# EAGLE design icestamp1k (EAGLE 9.6.2)
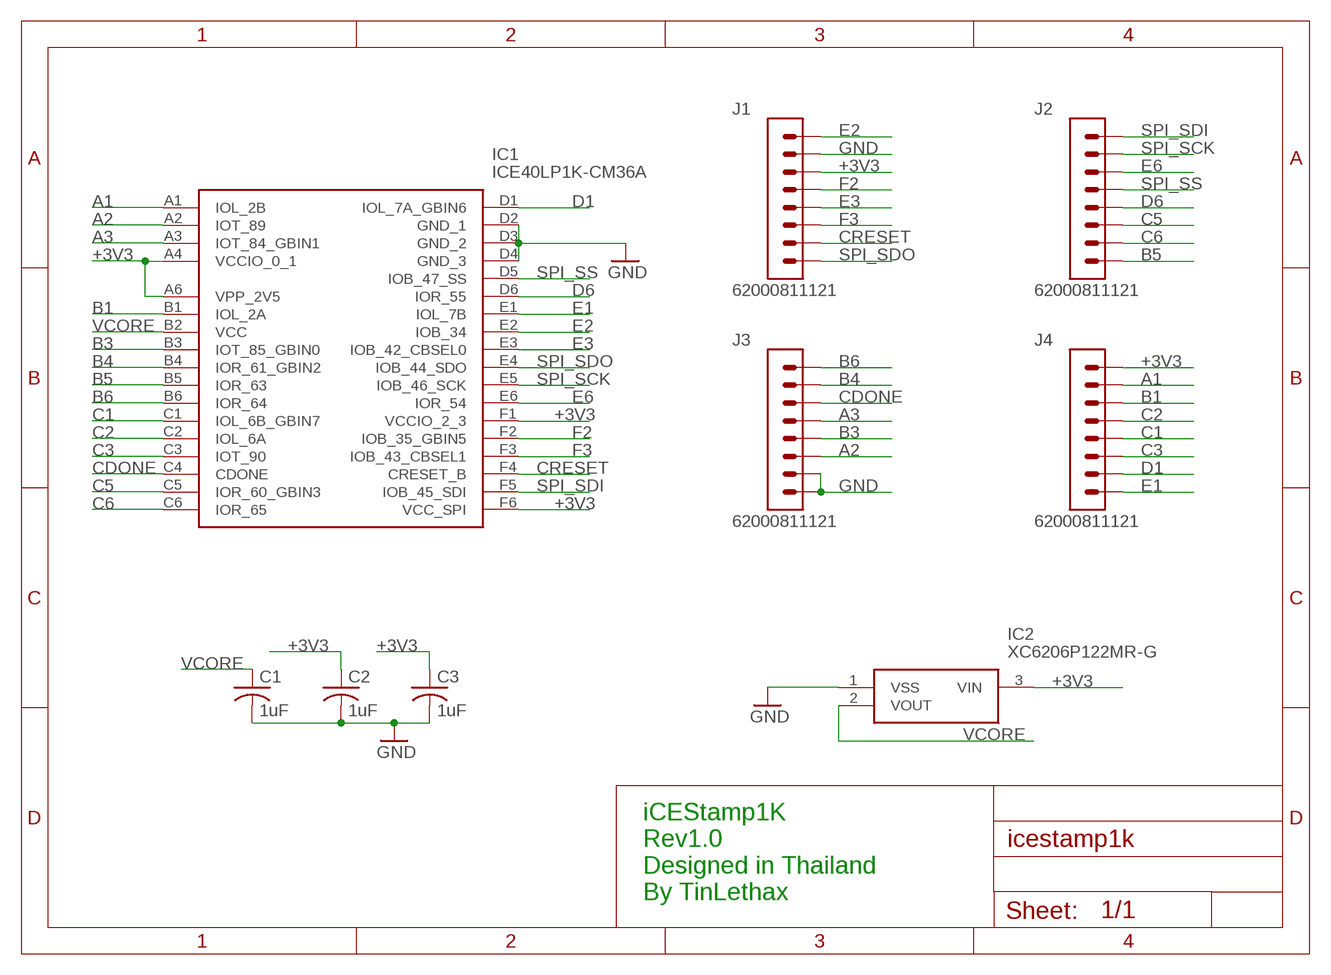
[diagram p0: schematic, sheet 1]

## Parts
C1  1uF  C-USC0603  [C0603]
C2  1uF  C-USC0603  [C0603]
C3  1uF  C-USC0603  [C0603]
IC1  ICE40LP1K-CM36A  [BGA36C40P6X6_250X250X100]
IC2  XC6206P122MR-G  [SOT95P280X130-3N]
J1  62000811121  [62000811121]
J2  62000811121  [62000811121]
J3  62000811121  [62000811121]
J4  62000811121  [62000811121]

## Nets
+3V3: C2.1 C3.1 IC1.A4(VCCIO_0_1) IC1.A6(VPP_2V5) IC1.F1(VCCIO_2_3) IC1.F6(VCC_SPI) IC2.3(VIN) J1.3 J4.1
A1: IC1.A1(IOL_2B) J4.2
A2: IC1.A2(IOT_89) J3.6
A3: IC1.A3(IOT_84_GBIN1) J3.4
B1: IC1.B1(IOL_2A) J4.3
B3: IC1.B3(IOT_85_GBIN0) J3.5
B4: IC1.B4(IOR_61_GBIN2) J3.2
B5: IC1.B5(IOR_63) J2.8
B6: IC1.B6(IOR_64) J3.1
C1: IC1.C1(IOL_6B_GBIN7) J4.5
C2: IC1.C2(IOL_6A) J4.4
C3: IC1.C3(IOT_90) J4.6
C5: IC1.C5(IOR_60_GBIN3) J2.6
C6: IC1.C6(IOR_65) J2.7
CDONE: IC1.C4(CDONE) J3.3
CRESET: IC1.F4(CRESET_B) J1.7
D1: IC1.D1(IOL_7A_GBIN6) J4.7
D6: IC1.D6(IOR_55) J2.5
E1: IC1.E1(IOL_7B) J4.8
E2: IC1.E2(IOB_34) J1.1
E3: IC1.E3(IOB_42_CBSEL0) J1.5
E6: IC1.E6(IOR_54) J2.3
F2: IC1.F2(IOB_35_GBIN5) J1.4
F3: IC1.F3(IOB_43_CBSEL1) J1.6
GND: C1.2 C2.2 C3.2 IC1.D2(GND_1) IC1.D3(GND_2) IC1.D4(GND_3) IC2.1(VSS) J1.2 J3.7 J3.8
SPI_SCK: IC1.E5(IOB_46_SCK) J2.2
SPI_SDI: IC1.F5(IOB_45_SDI) J2.1
SPI_SDO: IC1.E4(IOB_44_SDO) J1.8
SPI_SS: IC1.D5(IOB_47_SS) J2.4
VCORE: C1.1 IC1.B2(VCC) IC2.2(VOUT)

## Notes on the sheet
- iCEStamp1K
  Rev1.0
- Designed in Thailand
  By TinLethax

## Library data of the parts
C1-C3 = adafruit:C-US: CAPACITOR, American symbol
IC1 = ICE40LP1K-CM36A:ICE40LP1K-CM36A: iCE40 LP/HX/LM - Low-power, high-performance FPGA Source: Datasheet <http://www.latticesemi.com/iCE40>; DESCRIPTION: iCE40 LP/HX/LM - Low-power, high-performance FPGA; HEIGHT: 1mm; MANUFACTURER_NAME: Lattice Semiconductor; MANUFACTURER_PART_NUMBER: ICE40LP1K-CM36A; MOUSER_PART_NUMBER: 842-ICE40LP1K-CM36A; MOUSER_PRICE-STOCK: https://www.mouser.co.uk/ProductDetail/Lattice/ICE40LP1K-CM36A?qs=w%2Fv1CP2dgqpOjceq4EogWg%3D%3D
IC2 = XC6206P122MR-G:XC6206P122MR-G: LDO Voltage Regulators 1uA Low Quiescent 3 Terminal, Low ESR Cap. Compatible, Voltage Regulator Source: Datasheet <https://www.torexsemi.com/file/xc6206/XC6206.pdf>; DESCRIPTION: LDO Voltage Regulators 1uA Low Quiescent 3 Terminal, Low ESR Cap. Compatible, Voltage Regulator; HEIGHT: 1.3mm; MANUFACTURER_NAME: Torex; MANUFACTURER_PART_NUMBER: XC6206P122MR-G; MOUSER_PART_NUMBER: 865-XC6206P122MR-G; MOUSER_PRICE-STOCK: https://www.mouser.co.uk/ProductDetail/Torex-Semiconductor/XC6206P122MR-G?qs=AsjdqWjXhJ%2F35%2FU%2FZk2JYg%3D%3D
J1-J4 = Headers:62000811121: THT Vertical Pin Header WR-PHD, Pitch 2.00 mm, Single Row, 8 pins Manufacturer's datasheet <https://datasheet.octopart.com/62000811121-W%C3%BCrth-Elektronik-datasheet-117282012.pdf>; CREATED_BY: PCBLayout.com; MANUFACTURER: Würth Elektronik; MPN: 62000811121

## Board
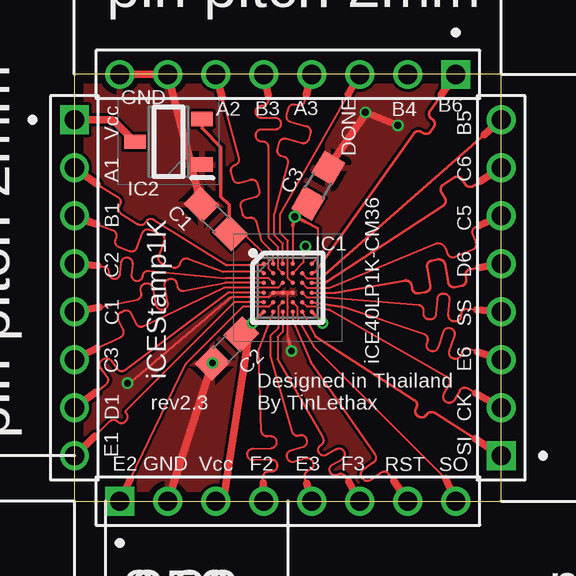
[diagram p1: board, top side]
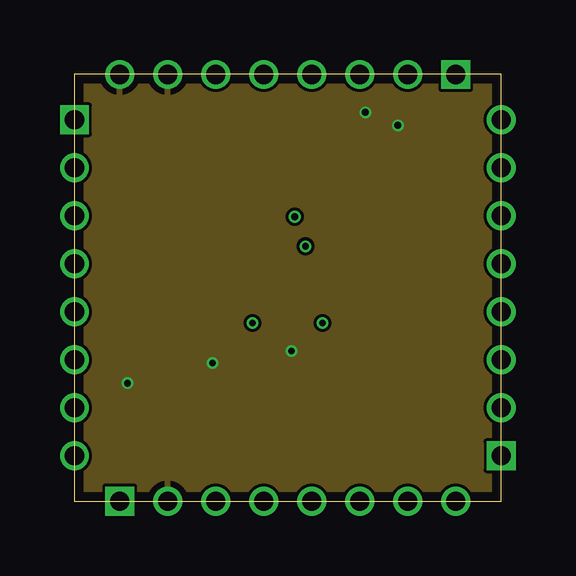
[diagram p2: board, inner layer Route2]
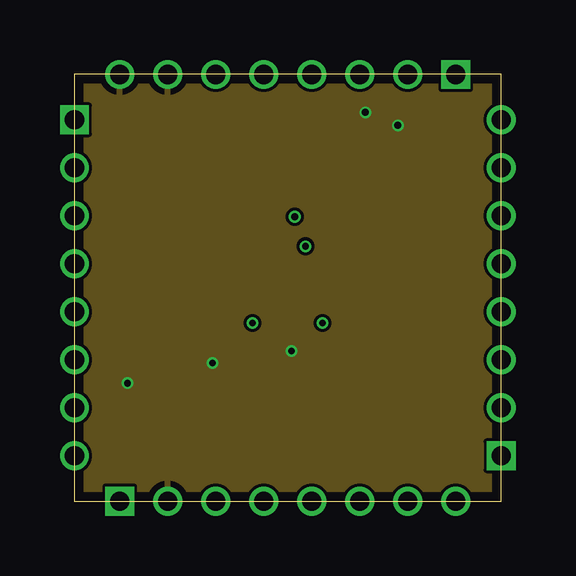
[diagram p3: board, inner layer Route15]
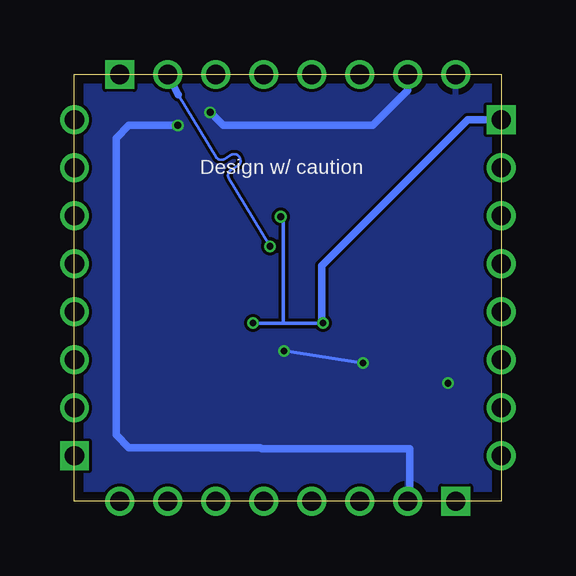
[diagram p4: board, bottom side, seen from below]

Size 17.78 x 17.78 mm. Coordinates in mm from the lower left corner, seen from the top.
Outline: 0,0 17.78,0 17.78,17.78 0,17.78 0,0
Copper layers (1*2*15*16): Top 0.035559375mm / dielectric 0.17018125mm / Route2 0.01778125mm / dielectric 47mil / Route15 0.01778125mm / dielectric 0.17018125mm / Bottom 0.035559375mm
Design rules "oshpark-4layer *": minimum track width 3mil, minimum drill 10mil, track to track 5mil, track to pad 5mil, pad to pad 5mil, via to via 5mil, smd to smd 5mil, copper to edge 15mil, drill to drill 6mil, minimum pad ring 4mil, minimum via ring 4mil, stop-mask expansion 0mil, vias tented up to drill 0mil, thermal gap 10mil

### Footprints (pad centres in the part's own frame; a part is rotated, then mirrored left to right if it is on the bottom)
C0603 = smd 1.1 x 1: 1 -0.85,0; 2 0.85,0
BGA36C40P6X6_250X250X100 = smd 0.18 x 0.18: A1 -1,1; A2 -0.6,1; A3 -0.2,1; A4 0.2,1; A6 1,1; B1 -1,0.6; B2 -0.6,0.6; B3 -0.2,0.6; B4 0.2,0.6; B5 0.6,0.6; B6 1,0.6; C1 -1,0.2; C2 -0.6,0.2; C3 -0.2,0.2; C4 0.2,0.2; C5 0.6,0.2; C6 1,0.2; D1 -1,-0.2; D2 -0.6,-0.2; D3 -0.2,-0.2; D4 0.2,-0.2; D5 0.6,-0.2; D6 1,-0.2; E1 -1,-0.6; E2 -0.6,-0.6; E3 -0.2,-0.6; E4 0.2,-0.6; E5 0.6,-0.6; E6 1,-0.6; F1 -1,-1; F2 -0.6,-1; F3 -0.2,-1; F4 0.2,-1; F5 0.6,-1; F6 1,-1
SOT95P280X130-3N = smd 0.9 x 0.6: 1 -1.4,0.95; 2 -1.4,-0.95; 3 1.4,0
62000811121 = drill 0.8 square: 1 -7,0 | drill 0.8: 2 -5,0; 3 -3,0; 4 -1,0; 5 1,0; 6 3,0; 7 5,0; 8 7,0

### Placement (x,y rotation side)
C1  5.89,11.76 135 top
C2  6.35,6.35 225 top
C3  10.16,13.14 60 top
IC1  8.89,8.89 0 top
IC2  3.92,14.97 180 top
J1  8.89,0 0 top
J2  17.78,8.89 90 top
J3  8.89,17.78 180 top
J4  0,8.89 270 top

### Tracks (layer width: path | path; a pad name or v marks a point on that pad's centre or on a via)
+3V3  (via drill 0.28)
  Top 0.089: 10.13,11.38 10.13,10.13 IC1.A6 | 9.09,11.48 IC1.A4
  Top 0.102: 9.62,11.63 10.13,11.38 | v9.18,11.85 C3.1
  Top 0.152: IC1.F1 v7.42,7.42 C2.1 7.11,6.8 7.25,6.77 | IC1.F6 10.34,7.44 v10.34,7.42 | 9.09,11.48 v9.18,11.85 9.62,11.63
  Top 0.305: 7.25,6.77 6.27,0.38 J1.3 | J4.1 1.61,15.89 IC2.3
  Bottom 0.152: v10.34,7.42 9.07,7.42 | 9.07,7.42 v7.42,7.42 | v9.18,11.85 9.07,11.73 9.07,7.42
  Bottom 0.305: J4.1 1.4,15.89 7.48,9.8 7.48,7.48 v7.42,7.42
A1
  Top 0.089: IC1.A1 7.83,9.83 6.35,9.83 3.32,11.73 arc90 2.99,11.65 2.97,11.62 arc-90 2.65,11.54 1.95,11.98 arc-90 1.87,12.3 1.89,12.34 arc90 1.82,12.66 0.96,13.2 0.23,13.66 J4.2
  Top 0.305: J4.2 0.96,13.2
A2
  Top 0.089: IC1.A2 8.29,10.35 7.79,10.85 7.58,11.64 arc90 7.29,11.81 arc-90 7,11.97 6.92,12.25 arc-90 7.09,12.54 7.54,12.66 arc90 7.7,12.95 7.63,13.23 arc90 7.34,13.39 6.89,13.27 arc-90 6.6,13.43 6.52,13.71 arc-90 6.69,14 arc90 6.85,14.29 6.16,16.8
  Top 0.305: J3.6 6.16,16.8
A3
  Top 0.089: IC1.A3 8.69,10.73 8.33,11.09 8.33,11.98 8.89,14.07 arc90 8.73,14.35 8.62,14.38 arc-90 8.45,14.67 8.52,14.93 arc-90 8.81,15.09 9.48,14.91 arc90 9.77,15.08 9.83,15.34 arc90 9.67,15.62 9,15.8 arc-90 8.84,16.09 8.9,16.35 arc-90 9.19,16.51 9.3,16.48 arc90 9.59,16.65 9.66,16.93
  Top 0.305: J3.4 9.66,16.93
B1
  Top 0.089: IC1.B1 7.83,9.55 6.19,9.55 4.74,10.1 arc90 4.44,9.96 4.41,9.88 arc-90 4.1,9.74 3.64,9.91 arc-90 3.5,10.22 3.74,10.83 arc90 3.6,11.13 3.14,11.31 arc90 2.84,11.17 2.6,10.56 arc-90 2.3,10.42 1.84,10.59 arc-90 1.7,10.9 1.74,10.98 arc90 1.6,11.29 0.93,11.54
  Top 0.305: J4.3 0.69,11.63 0.93,11.54
B3
  Top 0.089: IC1.B3 8.49,9.69 8.49,10.57 8.08,10.99 8.08,14.76 arc90 7.84,14.99 7.79,14.99 arc-90 7.55,15.23 7.55,15.25 arc-90 7.79,15.48 8.37,15.48 arc90 8.6,15.72 8.6,15.74 arc90 8.37,15.97 7.79,15.97 arc-90 7.55,16.21 7.55,16.23 arc-90 7.79,16.46 7.84,16.46 arc90 8.08,16.7 8.08,16.9
  Top 0.305: J3.5 8.08,16.9
B4  (via drill 0.28)
  Top 0.089: 9.54,10.2 9.54,9.94 IC1.B4
  Top 0.152: v9.63,10.62 9.54,10.2
  Bottom 0.102: 13.44,16.94 11.87,14.34 arc-90 11.54,14.25 11.25,14.43 arc90 10.92,14.35 10.89,14.3 arc90 10.97,13.97 11.26,13.79 arc-90 11.35,13.46 9.65,10.64 v9.63,10.62
  Bottom 0.305: J3.2 13.44,16.94
B5
  Top 0.089: IC1.B5 9.69,9.29 10.27,9.29 | 10.27,9.29 | 10.27,9.29 10.27,9.3
  Top 0.102: 17.07,15.27 10.27,9.29
  Top 0.305: J2.8 17.07,15.27
B6
  Top 0.102: IC1.B6 9.94,9.54 10.03,9.54 10.28,9.89 14.14,15.32 arc-90 14.48,15.37 14.51,15.35 arc90 14.85,15.4 14.97,15.57 arc90 14.91,15.91 14.88,15.94 arc-90 14.82,16.27 15.28,16.92
  Top 0.305: J3.1 15.29,16.93 15.28,16.92
C1
  Top 0.089: IC1.C1 6.28,9.09 6.27,9.09 4.56,8.77 arc-90 4.29,8.95 4.26,9.08 arc90 3.99,9.26 3.95,9.26 arc90 3.76,8.98 3.9,8.27 arc-90 3.71,8 3.67,7.99 arc-90 3.4,8.17 3.26,8.88 arc90 2.99,9.07 2.95,9.06 arc90 2.76,8.79 2.79,8.66 arc-90 2.6,8.39 1.03,8.09
  Top 0.305: J4.5 1.03,8.09
C2
  Top 0.089: IC1.C2 8.09,9.29 6.31,9.29 6.3,9.3 3.1,9.6 arc90 2.85,9.38 arc-90 2.59,9.17 2.59,9.17 arc-90 2.38,9.43 2.42,9.9 arc90 2.21,10.15 2.21,10.15 arc90 1.95,9.94 1.91,9.47 arc-90 1.65,9.26 1.65,9.26 arc-90 1.44,9.52 arc90 1.22,9.78 0.98,9.8
  Top 0.305: J4.4 0.98,9.8
C3
  Top 0.089: IC1.C3 8.49,8.89 6.22,8.89 2.88,7.29 arc-90 2.56,7.4 2.37,7.82 arc90 2.05,7.93 1.95,7.88 arc90 1.83,7.56 2.03,7.15 arc-90 1.92,6.83 0.93,6.36
  Top 0.305: J4.6 0.05,5.94 0.93,6.36
C5
  Top 0.089: IC1.C5 | IC1.C5 9.69,8.89 10.63,8.89 15.03,10.72 arc-90 15.45,10.55 15.55,10.29 arc90 15.85,10.17 16.61,10.49 arc90 16.74,10.79 16.6,11.12 arc-90 16.73,11.43 16.88,11.49
  Top 0.305: J2.6 16.88,11.49
C6
  Top 0.089: IC1.C6 10.45,9.09
  Top 0.102: 16.92,13.33 16.62,13.13 arc-90 16.28,13.2 16.15,13.4 arc90 15.81,13.47 15.37,13.18 arc90 15.3,12.85 15.43,12.64 arc-90 15.36,12.31 10.45,9.09
  Top 0.305: J2.7 16.92,13.33
CDONE
  Top 0.089: IC1.C4 8.89,9.29 8.89,10.86 8.59,11.16 8.59,11.98 11.42,16.95
  Top 0.305: J3.3 11.42,16.95
CRESET
  Top 0.089: IC1.F4 9.09,7.53 9.85,5.8 12.53,1.95 arc-90 12.48,1.62 12.04,1.31 arc90 11.98,0.99 12.02,0.94 arc90 12.34,0.88 12.78,1.18 arc-90 13.11,1.12 13.3,0.85
  Top 0.305: J1.7 13.3,0.85
D1
  Top 0.089: IC1.D1 6.39,8.69 2.12,5.46 arc-90 1.79,5.51 1.52,5.86 arc90 1.19,5.91 1.15,5.87 arc90 1.1,5.54 1.36,5.19 arc-90 1.32,4.86 0.89,4.54
  Top 0.305: J4.7 0.89,4.54
D6
  Top 0.089: IC1.D6 10.88,8.69
  Top 0.102: 16.84,9.73 16.5,9.67 arc90 16.3,9.39 16.33,9.25 arc-90 16.13,8.97 15.85,8.92 arc-90 15.57,9.12 15.44,9.87 arc90 15.16,10.07 14.89,10.02 arc90 14.69,9.74 14.82,8.98 arc-90 14.63,8.71 14.35,8.66 arc-90 14.07,8.85 14.05,8.99 arc90 13.77,9.19 10.88,8.69
  Top 0.305: J2.5 16.84,9.73
E1
  Top 0.089: IC1.E1 6.66,8.29 2.15,3.78 arc90 2.15,3.68 arc-90 2.15,3.34 2.13,3.32 arc-90 1.8,3.32 arc90 1.46,3.32 0.84,2.69
  Top 0.305: J4.8 0.57,2.44 0.84,2.69
E2
  Top 0.089: IC1.E2 8.29,8.28 8.1,8.09 7.01,8.09 4.64,5.72 2.33,0.91
  Top 0.305: J1.1 2.33,0.91
E3
  Top 0.089: IC1.E3 8.49,8.09 8.49,7.21 8.17,6.88 8.17,6.11 9.07,2.89 arc90 9.36,2.73 9.39,2.73 arc-90 9.68,2.57 9.69,2.54 arc-90 9.53,2.26 9.02,2.11 arc90 8.86,1.82 8.87,1.8 arc90 9.16,1.63 9.66,1.78 arc-90 9.95,1.61 9.96,1.59 arc-90 9.8,1.3 9.77,1.29 arc90 9.61,1 J1.5
  Top 0.305: J1.5 9.68,0.74
E6
  Top 0.089: 16.78,6.22 16.43,6.34 arc90 16.13,6.19 16.1,6.09 arc-90 15.8,5.94 15.78,5.95 arc-90 15.63,6.25 15.84,6.89 arc90 15.7,7.19 15.67,7.2 arc90 15.37,7.05 15.16,6.4 arc-90 14.86,6.25 14.83,6.26 arc-90 14.69,6.56 14.72,6.66 arc90 14.57,6.96 11.21,8.08
  Top 0.102: 11.21,8.08 IC1.E6
  Top 0.305: J2.3 16.78,6.22
F2
  Top 0.089: IC1.F2 7.68,6.34 7.79,2.92 arc90 8.04,2.69 8.19,2.7 arc-90 8.43,2.47 8.43,2.46 arc-90 8.2,2.21 7.43,2.19 arc90 7.21,1.95 7.21,1.93 arc90 7.45,1.7 8.22,1.73 arc-90 8.46,1.5 8.46,1.48 arc-90 8.23,1.24 8.09,1.24 arc90 7.86,0.99 7.87,0.77
  Top 0.305: J1.4 7.87,0.77
F3
  Top 0.089: IC1.F3 8.69,7.06 8.47,6.84 8.47,5.93 10.36,2.66 arc-90 10.27,2.34 arc90 10.19,2.02 10.19,2.01 arc90 10.51,1.93 10.92,2.16 arc-90 11.24,2.07 11.24,2.07 arc-90 11.15,1.75 10.74,1.52 arc90 10.66,1.2 10.66,1.19 arc90 10.98,1.1 arc-90 11.3,1.02 11.42,0.81
  Top 0.305: J1.6 11.42,0.81
GND  (via drill 0.28)
  Top 0.089: 8.88,8.69 8.89,8.68 8.89,6.9 8.92,6.77 | IC1.D2 8.09,8.49 6.53,8.49 2.31,4.92 v2.21,4.92
  Top 0.152: IC1.D2 8.88,8.69 IC1.D4 IC1.D3 | v9.04,6.26 8.92,6.77
  Top 0.254: 4.86,14.02 4.92,13.8
  Top 0.305: J1.2 C2.2 | J3.8 J3.7 4.86,14.02 IC2.1 | 4.92,13.8 C1.2 | v13.47,15.66 v12.12,16.2 12.12,16.11 C3.2
  Bottom 0.152: v9.04,6.26 5.73,5.74 C2.2
  Bottom 0.305: J3.7 3.89,17.12 5.35,15.66 11.58,15.66 v12.12,16.2 | v13.47,15.66 15.51,15.66 16.04,15.13 16.04,2.76 15.51,2.22 10.03,2.22 9.98,2.17 3.81,2.17 3.81,0.08 J1.2
  other vias: 5.75,5.75
  pour Top: 0,17.78 17.78,17.78 17.78,0 0,0
  pour Bottom: 0,17.78 17.78,17.78 17.78,0 0,0
  pour Route2: 0,0 17.78,0 17.78,17.78 0,17.78
  pour Route15: 0,17.78 17.78,17.78 17.78,0 0,0
SPI_SCK
  Top 0.089: IC1.E5 9.5,8.29 9.7,8.09 10.12,8.09 10.62,7.97 15.54,5.17 arc-90 15.62,4.85 15.4,4.45 arc90 15.49,4.13 15.51,4.12 arc90 15.83,4.21 16.05,4.61 arc-90 16.37,4.69 16.73,4.49
  Top 0.305: J2.2 16.73,4.49
SPI_SDI
  Top 0.089: IC1.F5 10.06,6.85
  Top 0.102: 10.06,6.85 14.17,4.21 arc-90 14.24,3.88 14.24,3.88 arc90 14.31,3.54 14.34,3.53 arc90 14.67,3.6 14.67,3.6 arc-90 15.01,3.67 16.69,2.59
  Top 0.305: J2.1 16.69,2.59
SPI_SDO
  Top 0.089: IC1.E4 9.29,8.09 9.29,7.64 9.99,6.41 15.47,0.94
  Top 0.305: J1.8 15.47,0.94
SPI_SS
  Top 0.089: IC1.D5 9.69,8.49 10.28,8.49 14.34,8.16 arc-90 14.55,7.91 14.55,7.83 arc90 14.76,7.58 14.81,7.57 arc90 15.07,7.79 15.12,8.42 arc-90 15.37,8.64 15.42,8.63 arc-90 15.64,8.38 15.59,7.75 arc90 15.8,7.49 15.85,7.49 arc90 16.11,7.7 16.11,7.79 arc-90 16.36,8 16.76,7.97
  Top 0.305: J2.4 16.76,7.97
VCORE
  Top 0.089: IC1.B2 8.09,9.69 8.09,10.11 7.04,11.16 6.66,11.16 C1.1
  Top 0.152: IC2.2 5.32,15.53 6.1,14.75 6.1,12.69 6.45,12.34 6.45,11.2 C1.1 | 6.31,11.5 6.66,11.16

### Text on the board
tNames: pin pitch 2mm | GND | A2 | B3 | A3 | DONE | B4 | B6 | Vcc | B5 | A1 | C6 | mm | mil | B1 | mil | C5 | mm | C2 | D6 | C1 | SS | C3 | iCE40LP1K-CM36 | iCEStamp1K | E6 | D1 | rev2.3 | Designed in Thailand / By TinLethax | pin pitch 2mm | E1 | CK | SI | E2 | GND | Vcc | F2 | E3 | F3 | RST | SO | mil | mm | mm | mil
bNames: Design w/ caution
tValues: mil | mm